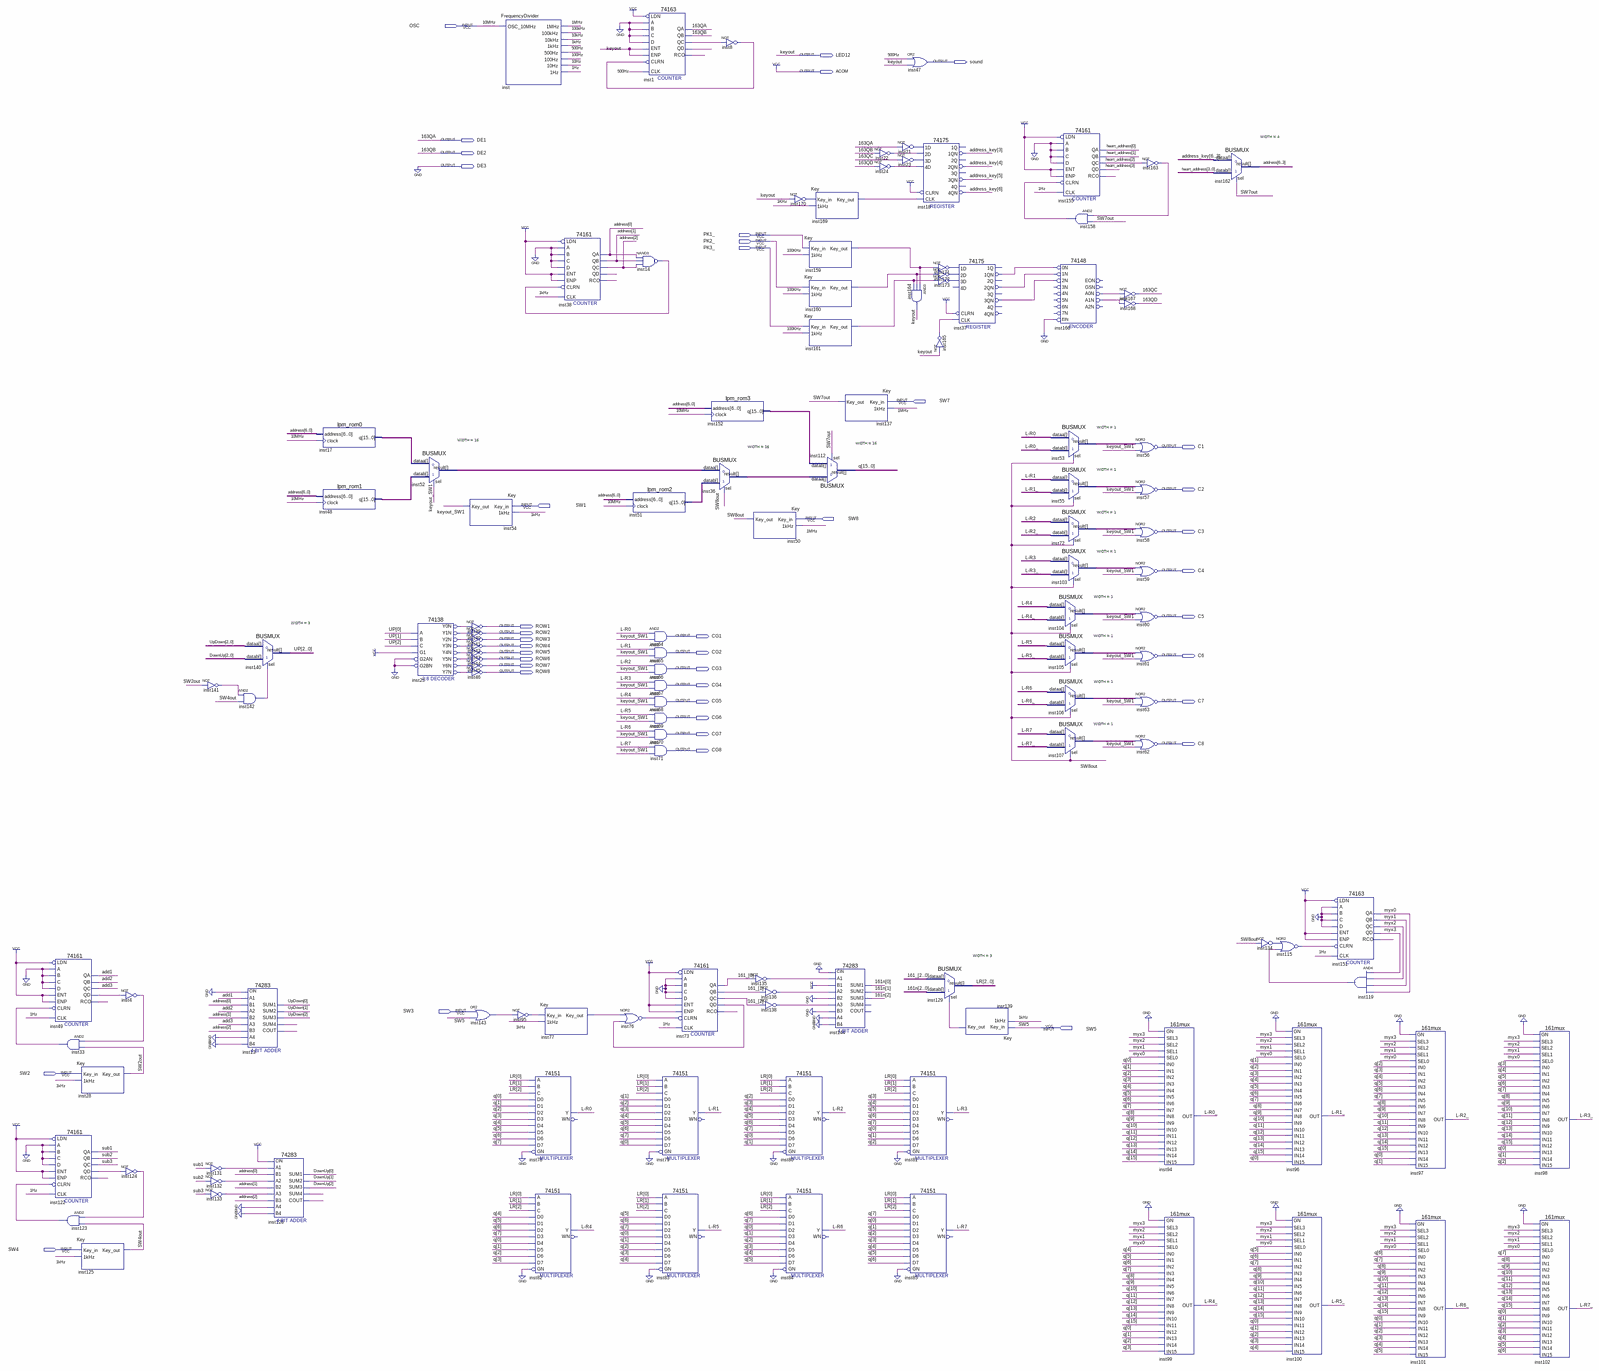
[diagram p0: schematic sheet, whole]
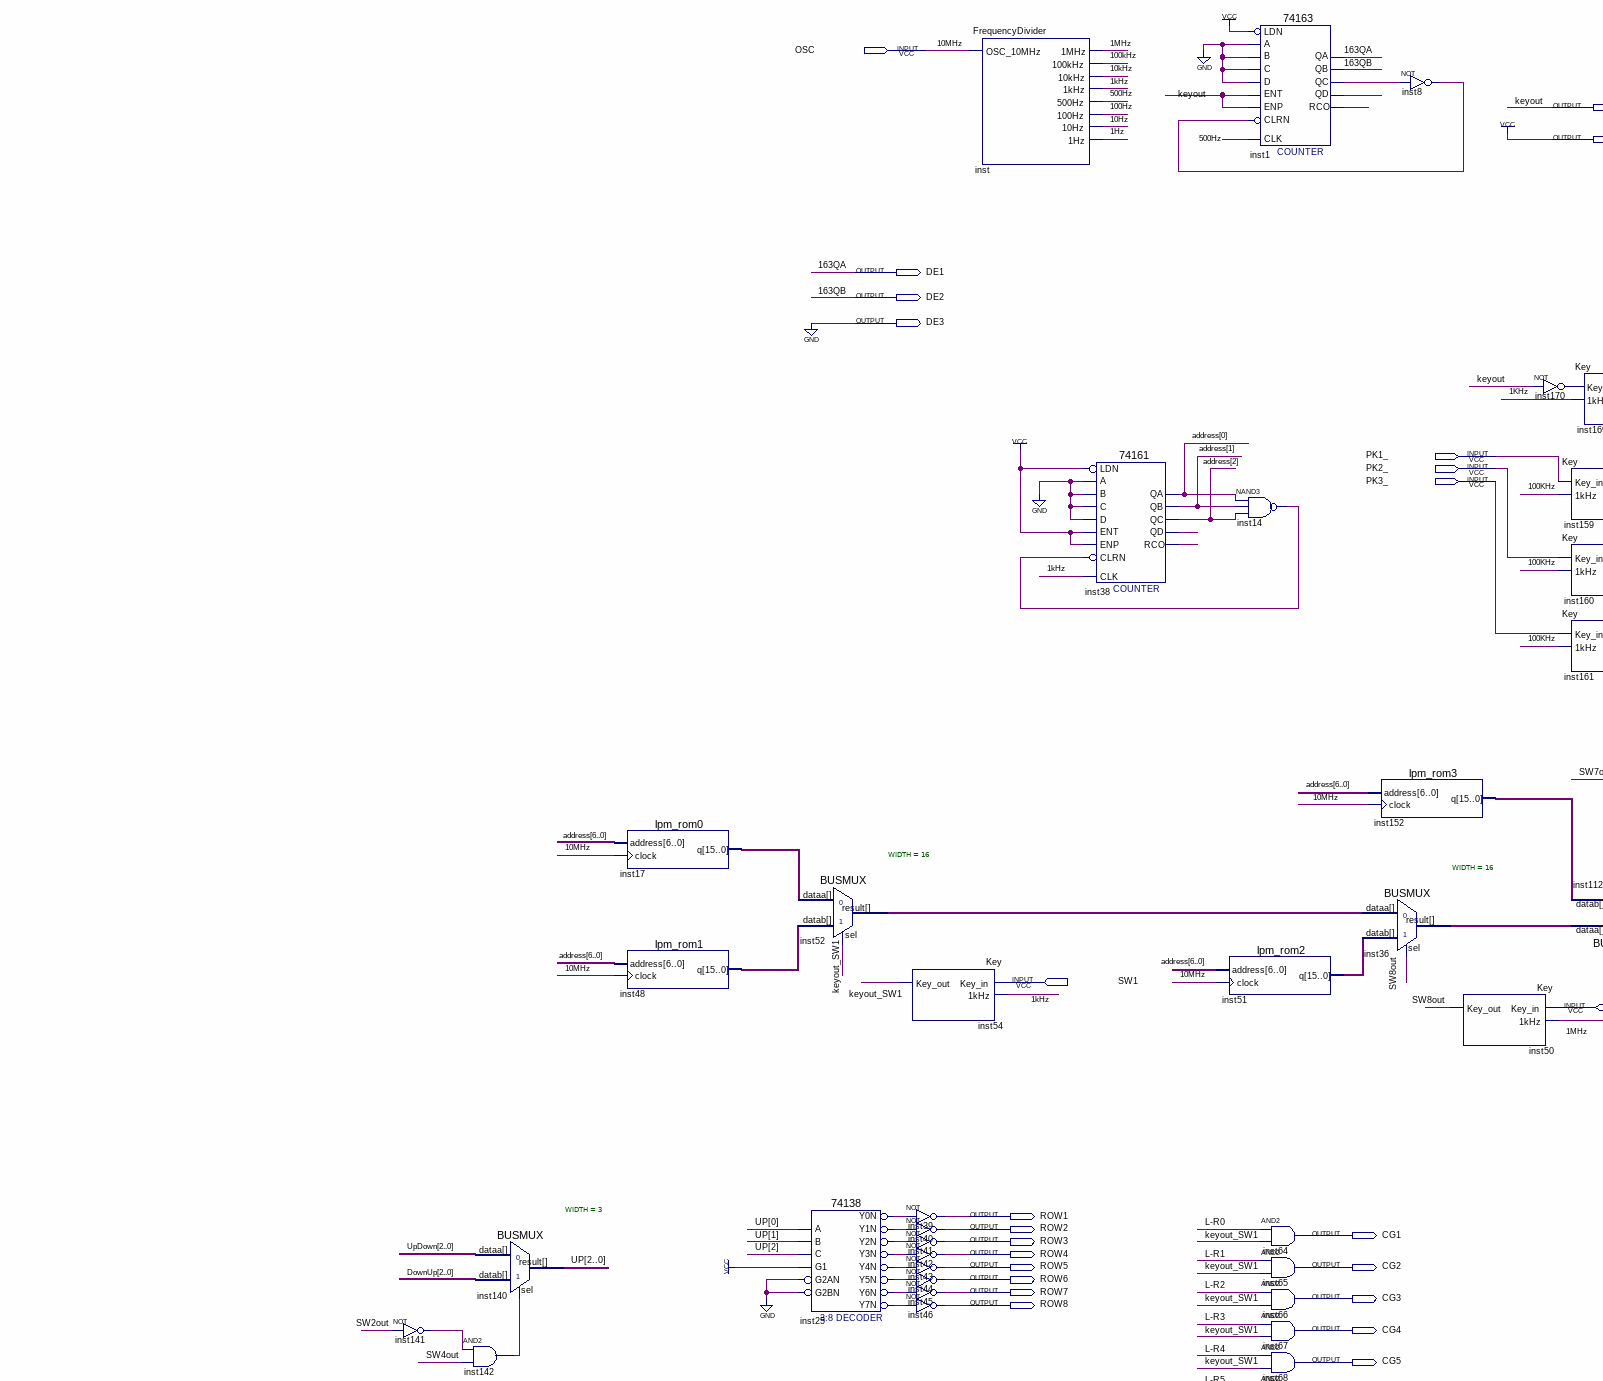
[diagram p1: schematic sheet, upper left part]
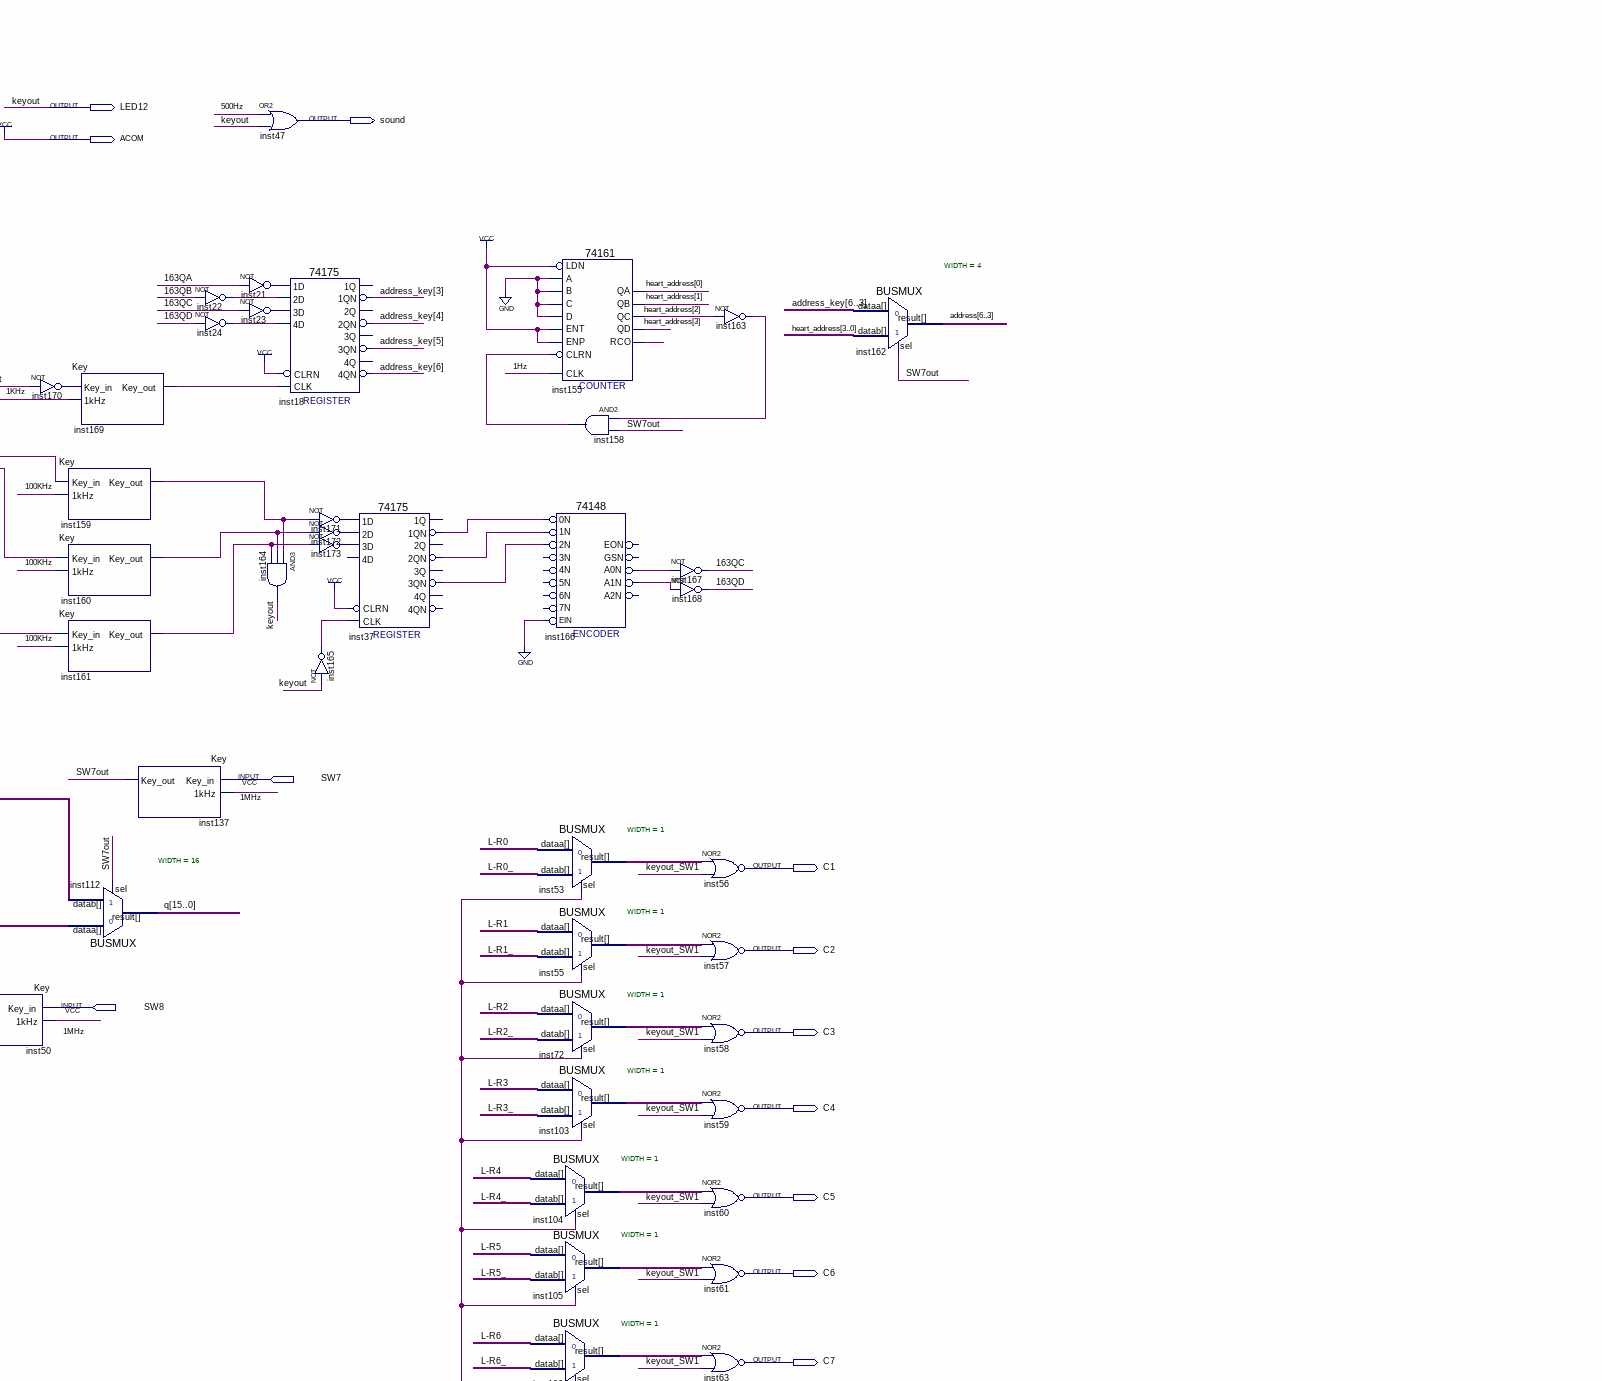
[diagram p2: schematic sheet, upper right part]
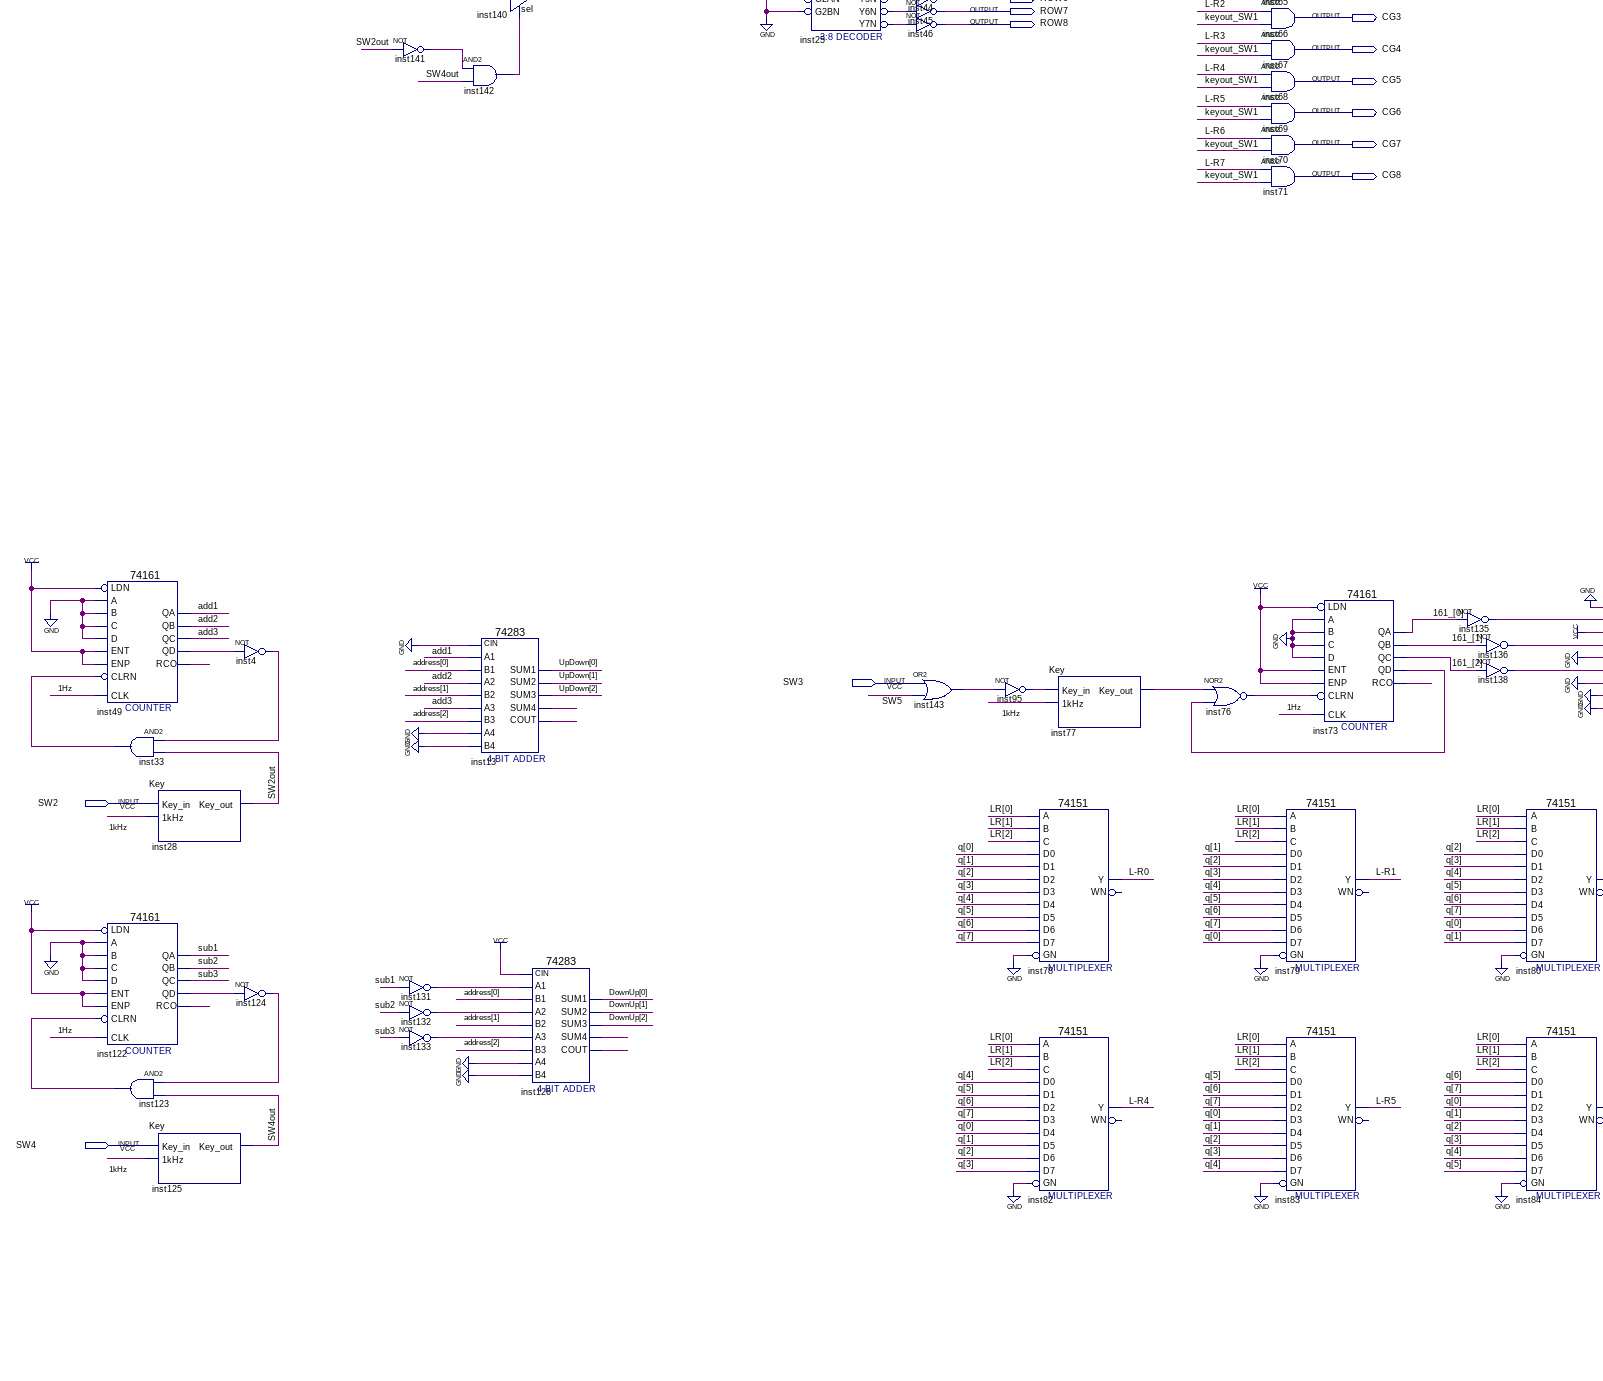
[diagram p3: schematic sheet, lower left part]
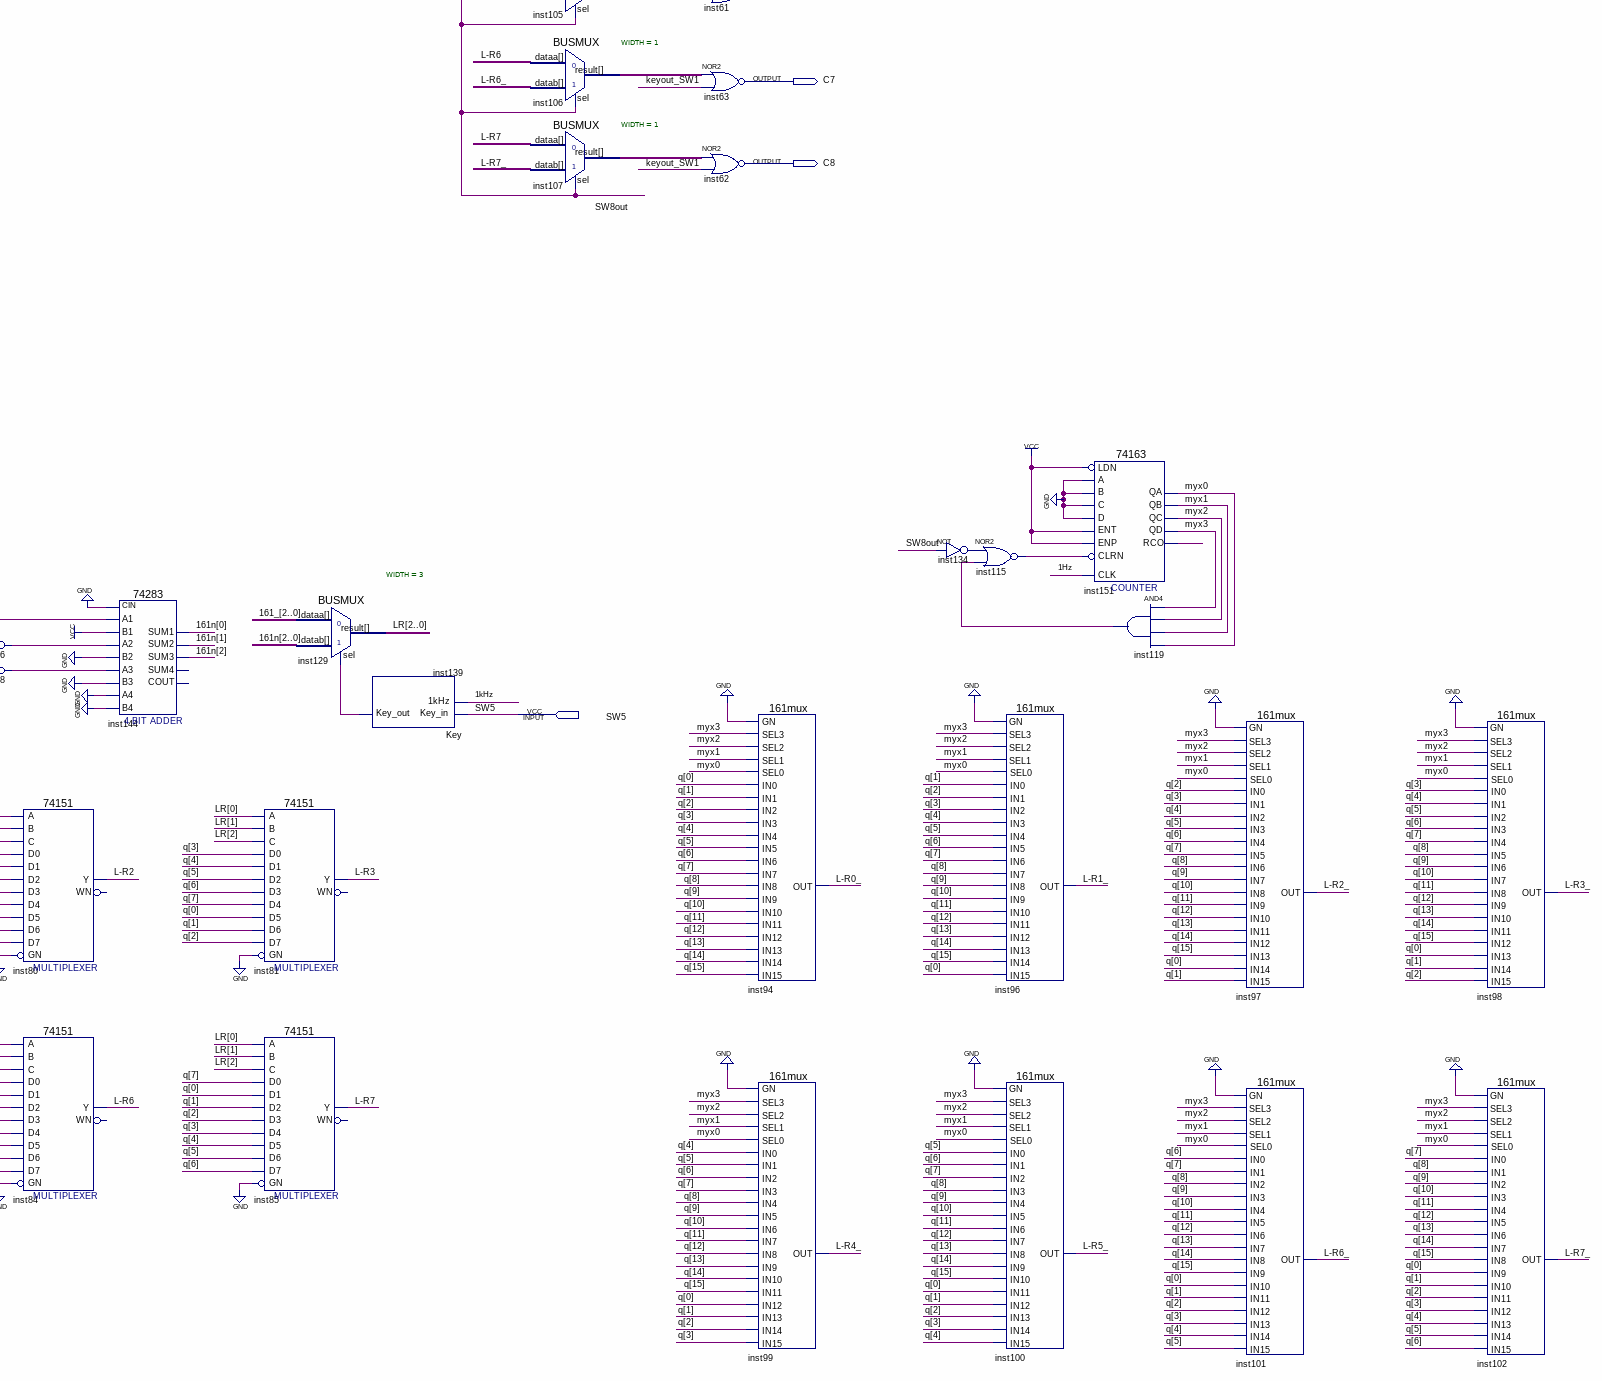
[diagram p4: schematic sheet, lower right part]
// Quartus schematic main.bdf as structural Verilog: 119 symbols, 41 pins
module main (
  input  OSC,
  input  PK1_,
  input  PK2_,
  input  PK3_,
  input  SW7,
  input  SW1,
  input  SW8,
  input  SW3,
  input  SW5,
  input  SW2,
  input  SW4,
  output LED12,
  output sound,
  output ACOM,
  output DE1,
  output DE2,
  output DE3,
  output C1,
  output C2,
  output C3,
  output C4,
  output C5,
  output ROW1,
  output ROW2,
  output CG1,
  output ROW3,
  output ROW4,
  output ROW5,
  output CG2,
  output C6,
  output ROW6,
  output ROW7,
  output CG3,
  output ROW8,
  output CG4,
  output CG5,
  output C7,
  output CG6,
  output CG7,
  output C8,
  output CG8
);

  wire \1Hz , \1kHz , \1MHz , \10Hz , \10kHz , \100Hz , \100kHz , \163QC , \163QD , \500Hz , add1, add2,
       add3, inst1_qc, inst1_qd, inst1_rco, inst4_out, inst8_out, inst13_cout, inst13_sum4, inst14_out,
       inst21_out, inst22_out, inst23_out, inst24_out, inst25_y0n, inst25_y1n, inst25_y2n, inst25_y3n,
       inst25_y4n, inst25_y5n, inst25_y6n, inst25_y7n, inst33_out, inst37_1qn, inst37_2qn, inst37_3qn,
       inst38_qd, inst38_rco, inst49_qd, inst49_rco, inst53_result, inst55_result, inst72_result, inst73_qd,
       inst73_rco, inst76_out, inst77_key_out, inst95_out, inst103_result, inst104_result, inst105_result,
       inst106_result, inst107_result, inst115_out, inst119_out, inst122_qd, inst122_rco, inst123_out,
       inst124_out, inst126_cout, inst126_sum4, inst131_out, inst132_out, inst133_out, inst134_out,
       inst135_out, inst136_out, inst138_out, inst139_key_out, inst141_out, inst142_out, inst143_out,
       inst151_rco, inst155_rco, inst158_out, inst159_key_out, inst160_key_out, inst161_key_out, inst163_out,
       inst165_out, inst166_a0n, inst166_a1n, inst169_key_out, inst170_out, inst171_out, inst172_out,
       inst173_out, keyout_SW1, \L-R0 , \L-R0_ , \L-R1 , \L-R1_ , \L-R2 , \L-R2_ , \L-R3 , \L-R3_ , \L-R4 ,
       \L-R4_ , \L-R5 , \L-R5_ , \L-R6 , \L-R6_ , \L-R7 , \L-R7_ , myx0, myx1, myx2, myx3, sub1, sub2, sub3,
       SW2out, SW4out, SW7out, SW8out;
  wire [2:0] \161_ , \161n , DownUp, LR, UP, UpDown;
  wire [3:0] heart_address;
  wire [6:0] address;
  wire [6:3] address_key;
  wire [15:0] inst17_q, inst36_result, inst48_q, inst51_q, inst52_result, inst152_q, q;

  \74161  inst49 (
    .CLRN(inst33_out), .CLK(\1Hz ), .ENP(1'b1), .LDN(1'b1), .A(1'b0), .D(1'b0), .ENT(1'b1), .B(1'b0),
    .C(1'b0), .QD(inst49_qd), .QC(add3), .QB(add2), .QA(add1), .RCO(inst49_rco));
  \74161  inst122 (
    .CLRN(inst123_out), .CLK(\1Hz ), .ENP(1'b1), .LDN(1'b1), .A(1'b0), .D(1'b0), .ENT(1'b1), .B(1'b0),
    .C(1'b0), .QD(inst122_qd), .QC(sub3), .QB(sub2), .QA(sub1), .RCO(inst122_rco));
  and inst33 (inst33_out, inst4_out, SW2out);
  Key inst28 (.Key_in(SW2), .\1kHz (\1kHz ), .Key_out(SW2out));
  and inst123 (inst123_out, inst124_out, SW4out);
  Key inst125 (.Key_in(SW4), .\1kHz (\1kHz ), .Key_out(SW4out));
  not inst4 (inst4_out, inst49_qd);
  not inst124 (inst124_out, inst122_qd);
  not inst141 (inst141_out, SW2out);
  not inst131 (inst131_out, sub1);
  not inst132 (inst132_out, sub2);
  not inst133 (inst133_out, sub3);
  and inst142 (inst142_out, inst141_out, SW4out);
  BUSMUX #(.WIDTH(3)) inst140 (.datab(DownUp), .sel(inst142_out), .dataa(UpDown), .result(UP));
  \74283  inst13 (
    .CIN(1'b0), .A1(add1), .A2(add2), .B2(address[1]), .A3(add3), .A4(1'b0), .B4(1'b0), .B1(address[0]),
    .B3(address[2]), .SUM4(inst13_sum4), .COUT(inst13_cout), .SUM1(UpDown[0]), .SUM2(UpDown[1]),
    .SUM3(UpDown[2]));
  \74283  inst126 (
    .CIN(1'b1), .A1(inst131_out), .A2(inst132_out), .B2(address[1]), .A3(inst133_out), .A4(1'b0), .B4(1'b0),
    .B1(address[0]), .B3(address[2]), .SUM4(inst126_sum4), .COUT(inst126_cout), .SUM1(DownUp[0]),
    .SUM2(DownUp[1]), .SUM3(DownUp[2]));
  lpm_rom0 inst17 (.address(address), .clock(OSC), .q(inst17_q));
  lpm_rom1 inst48 (.address(address), .clock(OSC), .q(inst48_q));
  BUSMUX #(.WIDTH(16)) inst52 (.datab(inst48_q), .sel(keyout_SW1), .dataa(inst17_q), .result(inst52_result));
  \74138  inst25 (
    .A(UP[0]), .B(UP[1]), .G1(1'b1), .C(UP[2]), .G2AN(1'b0), .G2BN(1'b0), .Y0N(inst25_y0n), .Y1N(inst25_y1n),
    .Y2N(inst25_y2n), .Y3N(inst25_y3n), .Y4N(inst25_y4n), .Y5N(inst25_y5n), .Y6N(inst25_y6n), .Y7N(inst25_y7n));
  Key inst54 (.Key_in(SW1), .\1kHz (\1kHz ), .Key_out(keyout_SW1));
  not inst39 (ROW1, inst25_y0n);
  not inst40 (ROW2, inst25_y1n);
  not inst41 (ROW3, inst25_y2n);
  not inst42 (ROW4, inst25_y3n);
  not inst43 (ROW5, inst25_y4n);
  not inst44 (ROW6, inst25_y5n);
  not inst45 (ROW7, inst25_y6n);
  not inst46 (ROW8, inst25_y7n);
  or inst143 (inst143_out, SW3, SW5);
  FrequencyDivider inst (
    .OSC_10MHz(OSC), .\1MHz (\1MHz ), .\100kHz (\100kHz ), .\10kHz (\10kHz ), .\1kHz (\1kHz ),
    .\500Hz (\500Hz ), .\100Hz (\100Hz ), .\10Hz (\10Hz ), .\1Hz (\1Hz ));
  not inst95 (inst95_out, inst143_out);
  Key inst77 (.Key_in(inst95_out), .\1kHz (\1kHz ), .Key_out(inst77_key_out));
  \74151  inst78 (
    .GN(1'b0), .C(LR[2]), .B(LR[1]), .A(LR[0]), .D5(q[5]), .D0(q[0]), .D1(q[1]), .D4(q[4]), .D3(q[3]),
    .D2(q[2]), .D6(q[6]), .D7(q[7]), .Y(\L-R0 ));  // open: WN
  \74151  inst82 (
    .GN(1'b0), .C(LR[2]), .B(LR[1]), .A(LR[0]), .D5(q[1]), .D0(q[4]), .D1(q[5]), .D4(q[0]), .D3(q[7]),
    .D2(q[6]), .D6(q[2]), .D7(q[3]), .Y(\L-R4 ));  // open: WN
  \74161  inst38 (
    .CLRN(inst14_out), .CLK(\1kHz ), .ENP(1'b1), .LDN(1'b1), .A(1'b0), .D(1'b0), .ENT(1'b1), .B(1'b0),
    .C(1'b0), .QD(inst38_qd), .QC(address[2]), .QB(address[1]), .QA(address[0]), .RCO(inst38_rco));
  lpm_rom2 inst51 (.address(address), .clock(OSC), .q(inst51_q));
  nor inst76 (inst76_out, inst77_key_out, inst73_qd);
  \74163  inst1 (
    .C(1'b0), .B(1'b0), .A(1'b0), .ENT(LED12), .D(1'b0), .CLRN(inst8_out), .CLK(\500Hz ), .ENP(LED12),
    .LDN(1'b1), .QA(DE1), .QB(DE2), .QC(inst1_qc), .QD(inst1_qd), .RCO(inst1_rco));
  nand inst14 (inst14_out, address[0], address[1], address[2]);
  and inst64 (CG1, \L-R0 , keyout_SW1);
  and inst65 (CG2, \L-R1 , keyout_SW1);
  and inst66 (CG3, \L-R2 , keyout_SW1);
  and inst67 (CG4, \L-R3 , keyout_SW1);
  and inst68 (CG5, \L-R4 , keyout_SW1);
  and inst69 (CG6, \L-R5 , keyout_SW1);
  and inst70 (CG7, \L-R6 , keyout_SW1);
  and inst71 (CG8, \L-R7 , keyout_SW1);
  \74151  inst79 (
    .GN(1'b0), .C(LR[2]), .B(LR[1]), .A(LR[0]), .D5(q[6]), .D0(q[1]), .D1(q[2]), .D4(q[5]), .D3(q[4]),
    .D2(q[3]), .D6(q[7]), .D7(q[0]), .Y(\L-R1 ));  // open: WN
  \74151  inst83 (
    .GN(1'b0), .C(LR[2]), .B(LR[1]), .A(LR[0]), .D5(q[2]), .D0(q[5]), .D1(q[6]), .D4(q[1]), .D3(q[0]),
    .D2(q[7]), .D6(q[3]), .D7(q[4]), .Y(\L-R5 ));  // open: WN
  \74161  inst73 (
    .CLRN(inst76_out), .CLK(\1Hz ), .ENP(1'b1), .LDN(1'b1), .A(1'b0), .D(1'b0), .ENT(1'b1), .B(1'b0),
    .C(1'b0), .QD(inst73_qd), .QC(\161_ [2]), .QB(\161_ [1]), .QA(\161_ [0]), .RCO(inst73_rco));
  lpm_rom3 inst152 (.address(address), .clock(OSC), .q(inst152_q));
  BUSMUX #(.WIDTH(16)) inst36 (.datab(inst51_q), .sel(SW8out), .dataa(inst52_result), .result(inst36_result));
  not inst8 (inst8_out, inst1_qc);
  Key inst50 (.Key_in(SW8), .\1kHz (\1MHz ), .Key_out(SW8out));
  not inst135 (inst135_out, \161_ [0]);
  not inst136 (inst136_out, \161_ [1]);
  not inst138 (inst138_out, \161_ [2]);
  \74151  inst80 (
    .GN(1'b0), .C(LR[2]), .B(LR[1]), .A(LR[0]), .D5(q[7]), .D0(q[2]), .D1(q[3]), .D4(q[6]), .D3(q[5]),
    .D2(q[4]), .D6(q[0]), .D7(q[1]), .Y(\L-R2 ));  // open: WN
  \74151  inst84 (
    .GN(1'b0), .C(LR[2]), .B(LR[1]), .A(LR[0]), .D5(q[3]), .D0(q[6]), .D1(q[7]), .D4(q[2]), .D3(q[1]),
    .D2(q[0]), .D6(q[4]), .D7(q[5]), .Y(\L-R6 ));  // open: WN
  Key inst169 (.Key_in(inst170_out), .\1kHz (\1kHz ), .Key_out(inst169_key_out));
  not inst170 (inst170_out, LED12);
  Key inst159 (.Key_in(PK1_), .\1kHz (\100kHz ), .Key_out(inst159_key_out));
  Key inst160 (.Key_in(PK2_), .\1kHz (\100kHz ), .Key_out(inst160_key_out));
  Key inst161 (.Key_in(PK3_), .\1kHz (\100kHz ), .Key_out(inst161_key_out));
  BUSMUX #(.WIDTH(16)) inst112 (.datab(inst152_q), .sel(SW7out), .dataa(inst36_result), .result(q));
  Key inst137 (.Key_in(SW7), .\1kHz (\1MHz ), .Key_out(SW7out));
  \74283  inst144 (
    .CIN(1'b0), .A1(inst135_out), .A2(inst136_out), .B2(1'b0), .A3(inst138_out), .A4(1'b0), .B4(1'b0),
    .B1(1'b1), .B3(1'b0), .SUM1(\161n [0]), .SUM2(\161n [1]), .SUM3(\161n [2]));  // open: SUM4, COUT
  not inst22 (inst22_out, DE2);
  not inst24 (inst24_out, \163QD );
  or inst47 (sound, \500Hz , LED12);
  \74175  inst18 (
    .CLRN(1'b1), .CLK(inst169_key_out), .\3D (inst23_out), .\2D (inst22_out), .\1D (inst21_out),
    .\4D (inst24_out), .\1QN (address_key[3]), .\2QN (address_key[4]), .\4QN (address_key[6]),
    .\3QN (address_key[5]));  // open: 1Q, 3Q, 2Q, 4Q
  not inst21 (inst21_out, DE1);
  not inst23 (inst23_out, \163QC );
  and inst164 (LED12, inst159_key_out, inst160_key_out, inst161_key_out);
  \74151  inst81 (
    .GN(1'b0), .C(LR[2]), .B(LR[1]), .A(LR[0]), .D5(q[0]), .D0(q[3]), .D1(q[4]), .D4(q[7]), .D3(q[6]),
    .D2(q[5]), .D6(q[1]), .D7(q[2]), .Y(\L-R3 ));  // open: WN
  \74151  inst85 (
    .GN(1'b0), .C(LR[2]), .B(LR[1]), .A(LR[0]), .D5(q[4]), .D0(q[7]), .D1(q[0]), .D4(q[3]), .D3(q[2]),
    .D2(q[1]), .D6(q[5]), .D7(q[6]), .Y(\L-R7 ));  // open: WN
  not inst171 (inst171_out, inst159_key_out);
  not inst172 (inst172_out, inst160_key_out);
  not inst173 (inst173_out, inst161_key_out);
  not inst165 (inst165_out, LED12);
  BUSMUX #(.WIDTH(3)) inst129 (.datab(\161n ), .sel(inst139_key_out), .dataa(\161_ ), .result(LR));
  \74175  inst37 (
    .CLRN(1'b1), .CLK(inst165_out), .\3D (inst173_out), .\2D (inst172_out), .\1D (inst171_out),
    .\1QN (inst37_1qn), .\2QN (inst37_2qn), .\3QN (inst37_3qn));  // open: 4D, 1Q, 3Q, 2Q, 4QN, 4Q
  Key inst139 (.Key_in(SW5), .\1kHz (\1kHz ), .Key_out(inst139_key_out));
  BUSMUX #(.WIDTH(1)) inst104 (.datab(\L-R4_ ), .sel(SW8out), .dataa(\L-R4 ), .result(inst104_result));
  BUSMUX #(.WIDTH(1)) inst105 (.datab(\L-R5_ ), .sel(SW8out), .dataa(\L-R5 ), .result(inst105_result));
  BUSMUX #(.WIDTH(1)) inst106 (.datab(\L-R6_ ), .sel(SW8out), .dataa(\L-R6 ), .result(inst106_result));
  BUSMUX #(.WIDTH(1)) inst107 (.datab(\L-R7_ ), .sel(SW8out), .dataa(\L-R7 ), .result(inst107_result));
  \74161  inst155 (
    .CLRN(inst158_out), .CLK(\1Hz ), .ENP(1'b1), .LDN(1'b1), .A(1'b0), .D(1'b0), .ENT(1'b1), .B(1'b0),
    .C(1'b0), .QD(heart_address[3]), .QC(heart_address[2]), .QB(heart_address[1]), .QA(heart_address[0]),
    .RCO(inst155_rco));
  and inst158 (inst158_out, inst163_out, SW7out);
  \74148  inst166 (
    .\0N (inst37_1qn), .\1N (inst37_2qn), .\2N (inst37_3qn), .EIN(1'b0), .A1N(inst166_a1n), .A0N(inst166_a0n));  // open: 5N, 3N, 4N, 6N, 7N, A2N, EON, GSN
  BUSMUX #(.WIDTH(1)) inst53 (.datab(\L-R0_ ), .sel(SW8out), .dataa(\L-R0 ), .result(inst53_result));
  BUSMUX #(.WIDTH(1)) inst55 (.datab(\L-R1_ ), .sel(SW8out), .dataa(\L-R1 ), .result(inst55_result));
  BUSMUX #(.WIDTH(1)) inst72 (.datab(\L-R2_ ), .sel(SW8out), .dataa(\L-R2 ), .result(inst72_result));
  BUSMUX #(.WIDTH(1)) inst103 (.datab(\L-R3_ ), .sel(SW8out), .dataa(\L-R3 ), .result(inst103_result));
  not inst167 (\163QC , inst166_a0n);
  not inst168 (\163QD , inst166_a1n);
  not inst163 (inst163_out, heart_address[2]);
  nor inst56 (C1, inst53_result, keyout_SW1);
  nor inst57 (C2, inst55_result, keyout_SW1);
  nor inst58 (C3, inst72_result, keyout_SW1);
  nor inst59 (C4, inst103_result, keyout_SW1);
  nor inst60 (C5, inst104_result, keyout_SW1);
  nor inst61 (C6, inst105_result, keyout_SW1);
  nor inst63 (C7, inst106_result, keyout_SW1);
  nor inst62 (C8, inst107_result, keyout_SW1);
  \161mux  inst94 (
    .SEL3(myx3), .GN(1'b0), .IN0(q[0]), .SEL0(myx0), .SEL1(myx1), .SEL2(myx2), .IN3(q[3]), .IN2(q[2]),
    .IN1(q[1]), .IN6(q[6]), .IN5(q[5]), .IN4(q[4]), .IN9(q[9]), .IN8(q[8]), .IN7(q[7]), .IN11(q[11]),
    .IN12(q[12]), .IN10(q[10]), .IN15(q[15]), .IN14(q[14]), .IN13(q[13]), .OUT(\L-R0_ ));
  \161mux  inst99 (
    .SEL3(myx3), .GN(1'b0), .IN0(q[4]), .SEL0(myx0), .SEL1(myx1), .SEL2(myx2), .IN3(q[7]), .IN2(q[6]),
    .IN1(q[5]), .IN6(q[10]), .IN5(q[9]), .IN4(q[8]), .IN9(q[13]), .IN8(q[12]), .IN7(q[11]), .IN11(q[15]),
    .IN12(q[0]), .IN10(q[14]), .IN15(q[3]), .IN14(q[2]), .IN13(q[1]), .OUT(\L-R4_ ));
  BUSMUX #(.WIDTH(4)) inst162 (.datab(heart_address), .sel(SW7out), .dataa(address_key), .result(address[6:3]));
  not inst134 (inst134_out, SW8out);
  nor inst115 (inst115_out, inst134_out, inst119_out);
  \161mux  inst96 (
    .SEL3(myx3), .GN(1'b0), .IN0(q[1]), .SEL0(myx0), .SEL1(myx1), .SEL2(myx2), .IN3(q[4]), .IN2(q[3]),
    .IN1(q[2]), .IN6(q[7]), .IN5(q[6]), .IN4(q[5]), .IN9(q[10]), .IN8(q[9]), .IN7(q[8]), .IN11(q[12]),
    .IN12(q[13]), .IN10(q[11]), .IN15(q[0]), .IN14(q[15]), .IN13(q[14]), .OUT(\L-R1_ ));
  \161mux  inst100 (
    .SEL3(myx3), .GN(1'b0), .IN0(q[5]), .SEL0(myx0), .SEL1(myx1), .SEL2(myx2), .IN3(q[8]), .IN2(q[7]),
    .IN1(q[6]), .IN6(q[11]), .IN5(q[10]), .IN4(q[9]), .IN9(q[14]), .IN8(q[13]), .IN7(q[12]), .IN11(q[0]),
    .IN12(q[1]), .IN10(q[15]), .IN15(q[4]), .IN14(q[3]), .IN13(q[2]), .OUT(\L-R5_ ));
  \74163  inst151 (
    .C(1'b0), .B(1'b0), .A(1'b0), .ENT(1'b1), .D(1'b0), .CLRN(inst115_out), .CLK(\1Hz ), .ENP(1'b1),
    .LDN(1'b1), .QA(myx0), .QB(myx1), .QC(myx2), .QD(myx3), .RCO(inst151_rco));
  and inst119 (inst119_out, myx3, myx2, myx1, myx0);
  \161mux  inst97 (
    .SEL3(myx3), .GN(1'b0), .IN0(q[2]), .SEL0(myx0), .SEL1(myx1), .SEL2(myx2), .IN3(q[5]), .IN2(q[4]),
    .IN1(q[3]), .IN6(q[8]), .IN5(q[7]), .IN4(q[6]), .IN9(q[11]), .IN8(q[10]), .IN7(q[9]), .IN11(q[13]),
    .IN12(q[14]), .IN10(q[12]), .IN15(q[1]), .IN14(q[0]), .IN13(q[15]), .OUT(\L-R2_ ));
  \161mux  inst101 (
    .SEL3(myx3), .GN(1'b0), .IN0(q[6]), .SEL0(myx0), .SEL1(myx1), .SEL2(myx2), .IN3(q[9]), .IN2(q[8]),
    .IN1(q[7]), .IN6(q[12]), .IN5(q[11]), .IN4(q[10]), .IN9(q[15]), .IN8(q[14]), .IN7(q[13]), .IN11(q[1]),
    .IN12(q[2]), .IN10(q[0]), .IN15(q[5]), .IN14(q[4]), .IN13(q[3]), .OUT(\L-R6_ ));
  \161mux  inst98 (
    .SEL3(myx3), .GN(1'b0), .IN0(q[3]), .SEL0(myx0), .SEL1(myx1), .SEL2(myx2), .IN3(q[6]), .IN2(q[5]),
    .IN1(q[4]), .IN6(q[9]), .IN5(q[8]), .IN4(q[7]), .IN9(q[12]), .IN8(q[11]), .IN7(q[10]), .IN11(q[14]),
    .IN12(q[15]), .IN10(q[13]), .IN15(q[2]), .IN14(q[1]), .IN13(q[0]), .OUT(\L-R3_ ));
  \161mux  inst102 (
    .SEL3(myx3), .GN(1'b0), .IN0(q[7]), .SEL0(myx0), .SEL1(myx1), .SEL2(myx2), .IN3(q[10]), .IN2(q[9]),
    .IN1(q[8]), .IN6(q[13]), .IN5(q[12]), .IN4(q[11]), .IN9(q[0]), .IN8(q[15]), .IN7(q[14]), .IN11(q[2]),
    .IN12(q[3]), .IN10(q[1]), .IN15(q[6]), .IN14(q[5]), .IN13(q[4]), .OUT(\L-R7_ ));

  assign ACOM = 1'b1;
  assign DE3 = 1'b0;

  // Other names for the same wires on the sheet: 10MHz = OSC; 163QA = DE1; 163QB = DE2; keyout = LED12
endmodule
